# Altium schematic sheet CLK_PCF2123_RTC.SchDoc: SPI Real Time Clock
size A4; Organization: Altium Limited.; Address1: Level 3, 12a Rodborough Rd; Address2: Frenchs Forest 2086; Address3: NSW; Address4: AUSTRALIA; DocumentNumber: 33; Revision: 6; SheetNumber: 34; SheetTotal: 77; PageSetup: Record=PageOptions|CenterHorizontal=True|CenterVertical=True|PrintScale=2.81|XCorrection=1.00|YCorrection=1.00|PrintKind=0|BorderSize=5000000|LeftOffset=0|BottomOffset=0|Orientation=2|PaperLength=1000|PaperWidth=1000|Scale=100|PaperSource=7|PrintQuality=-4|MediaType=1|DitherType=10|PaperKind=A1 (594 x 841mm)|PrintScaleMode=1
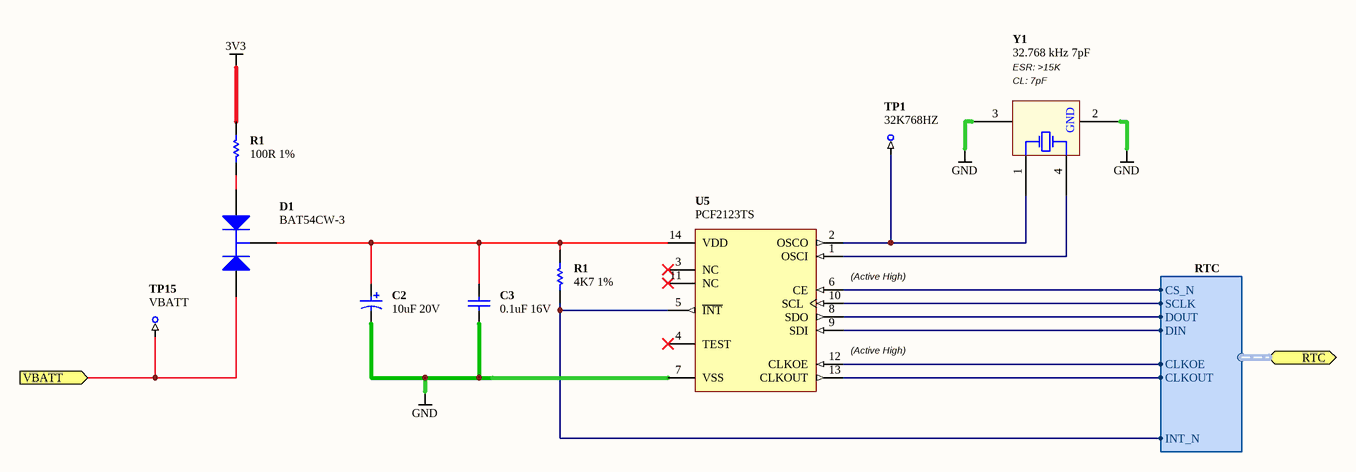
[diagram p0: CLK_PCF2123_RTC.SchDoc]

## Parts
(Parts that share a designator on the sheet are numbered #1, #2 ... from top to bottom, then left to right.)
C2  10uF 20V  [CAPC3528-STAR]
C3  0.1uF 16V  [CAPC1005-STAR]
D1  BAT54CW-3  [SOT323-3AL]
R1#1  100R 1%  [RESC1005-STAR]
R1#2  4K7 1%  [RESC1005-STAR]
TP1  32K768HZ  [TestPin]  (no BOM)
TP15  VBATT  [TestPin]  (no BOM)
U5  PCF2123TS  [TSOP65P640-14AN]
Y1  32.768 kHz 7pF  [ECS-71]

## Ports
RTC (harness RTC), VBATT (in)

## Harnesses
RTC: CS_N, DIN, DOUT, INT_N, SCLK, CLKOUT, CLKOE

## Nets
3V3: R1#1.1
GND: C2.2 C3.2 U5.7(VSS) Y1.2(GND) Y1.3(X2)
VBATT: D1.2(A2) TP15.1 ; port VBATT
NetC2_1: C2.1 C3.1 D1.3(K) R1#2.1 U5.14(VDD)
NetD1_1: D1.1(A1) R1#1.2
NetR1#2_2: R1#2.2 U5.5(~{INT}) ; port RTC.INT_N
NetTP1_1: TP1.1 U5.2(OSCO) Y1.1(X1)
NetU5_1: U5.1(OSCI) Y1.4(GND)
NetU5_6: U5.6(CE) ; port RTC.CS_N
NetU5_8: U5.8(SDO) ; port RTC.DOUT
NetU5_9: U5.9(SDI) ; port RTC.DIN
NetU5_10: U5.10(SCL) ; port RTC.SCLK
NetU5_12: U5.12(CLKOE) ; port RTC.CLKOE
NetU5_13: U5.13(CLKOUT) ; port RTC.CLKOUT

Not connected (* = marked no-connect by the designer): U5 3(NC)* 4(TEST)* 11(NC)*

## Notes on the sheet
- (near Y1) ESR: >15K
- (near Y1) CL: 7pF
- (near U5) (Active High)
- Sheet Title
- Project Title
- Size:
- Date:
- A4
- Assy:
- Time:
- Revision:
- Sheet
- of
- File:

## Library data of the parts
C2 = D-101-0007: Capacitor, Tantalum, 10uF 10% 20V MCCT-B (3528); Polarity: Polarized; Category: Capacitor; Capacitance: 10 uF; Mounting Technology: Surface Mount; Rated Voltage: 20 V; Status: Production; Technology: Tantalum; Tolerance: 10 %
C3 = D-101-0080: Capacitor, Ceramic, 0.1uF 10% 16V 0402 (1005) X7R; Polarity: Non-Polarized; Category: Capacitor; Capacitance: 0.1 uF; Dielectric: X7R; Mounting Technology: Surface Mount; Rated Voltage: 16 V; Status: Production; Technology: Ceramic; Tolerance: 10 %
D1 = D-155-0001: BAT54CW, SOT-323 Plastic-Encapsulated Diode; Max Forward Current: 200mA; Rated Voltage: 30V; Mounting Technology: Surface Mount; Status: Unreleased; Category: Signal Diode
R1#1 = D-100-0131: Resistor, 100R 1% 0402 (1005); Power Rating: 63 mW; Category: Resistor; Mounting Technology: Surface Mount; Resistance: 100 R; Status: Production; Tolerance: 1 %
R1#2 = D-100-0088: Resistor, 4K7 1% 0402 (1005); Power Rating: 63 mW; Resistance: 4.7 K; Category: Resistor; Mounting Technology: Surface Mount; Status: Production; Tolerance: 1 %
TP1 TP15 = D-006-0000: Test Point, PCB Mount with Silkscreen Box; Category: Test-Point; Status: Production
U5 = D-206-0006: PCF2123TS, SPI Real time clock/calendar, TSSOP14; Nominal Fequency: 32.768 KHz; Mounting Technology: Surface Mount; Status: Unreleased; Temperature Range: -40 to +85 degC; Category: IC-Clock
Y1 = D-103-0031: Crystal, 32.768 KHz Surface Mount; Frequency Stability: 20ppm; Frequency Tolerance: ppm; Nominal Operational Voltage: mV; Load Capacitance: 7pF; Mounting Technology: Surface Mount; Nominal Fequency: 32.768KHz; Status: Production; Category: Crystal